# Altium schematic sheet ETH_CON.SchDoc
size A4
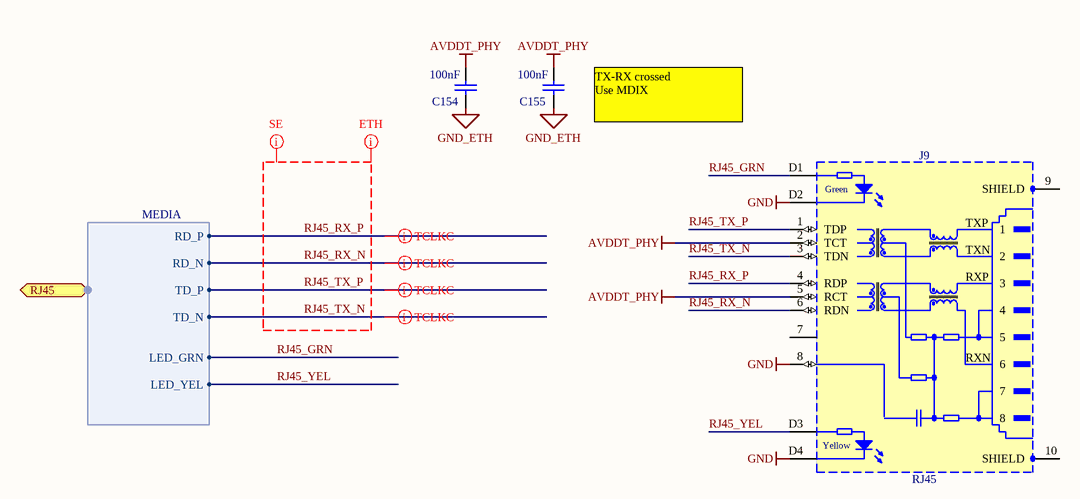
[diagram p0: ETH_CON.SchDoc]

## Parts
C154  100nF  [CAPC0603X33N]
C155  100nF  [CAPC0603X33N]
J9  RJ45  [TYCO_5-6605308-1]

## Ports
RJ45 (harness MEDIA)

## Harnesses
MEDIA: TD_P, TD_N, RD_P, RD_N, LED_GRN, LED_YEL

## Nets
AVDDT_PHY: C154.2 C155.2 J9.2(TCT) J9.5(RCT)
GND: J9.8 J9.D2 J9.D4
GND_ETH: C154.1 C155.1
RJ45_GRN: J9.D1 ; port RJ45.LED_GRN
RJ45_RX_N: J9.6(RDN) ; port RJ45.RD_N
RJ45_RX_P: J9.4(RDP) ; port RJ45.RD_P
RJ45_TX_N: J9.3(TDN) ; port RJ45.TD_N
RJ45_TX_P: J9.1(TDP) ; port RJ45.TD_P
RJ45_YEL: J9.D3 ; port RJ45.LED_YEL

Not connected (* = marked no-connect by the designer): J9 7 9(SHIELD) 10(SHIELD)

## Layout directives
differential pair: RJ45_RX_N, RJ45_RX_P, RJ45_TX_N, RJ45_TX_P
net class ETH: RJ45_RX_N, RJ45_RX_P, RJ45_TX_N, RJ45_TX_P
net class SE: RJ45_RX_N, RJ45_RX_P, RJ45_TX_N, RJ45_TX_P

## Notes on the sheet
- (near C155) TX-RX crossed
  Use MDIX
- (in symbol TYCO_5-6605308-1) Green; TXP; TXN; RXP; RXN; Yellow

## Library data of the parts
C154 C155 = CC0201_100NF_6.3V_10%_X5R: Non-polarised capacitor; Part Description: SMD Multilayer Chip Ceramic Capacitor; Manufacturer: GENERIC; Manufacturer1 Part Number: 02016D104KAT2A; Voltage: 6.3V; TC: X5R; Tolerance: ±10%; Table: Capacitors SMD; Part Number: CC0201_100NF_6.3V_10%_X5R; Component Kind: Standard; Component Type: Standard; Pin Count: 2; Value: 100nF; Status: Not Recommended; Manufacturer Part Number: CC0201_100NF_6.3V_10%_X5R; Case: 0201; Mounted: Yes; Socket: No; SMD: Yes; Manufacturer1 Example: AVX; Manufacturer1 ComponentHeight: 0.33mm; HelpURL: \\cern.ch\dfs\Applications\Altium\Datasheets\CC0201_X5R_AVX.pdf; Author: CERN DEM JLC; CreateDate: 2007-12-03; LatestRevisionDate: 2007-12-03
J9 = TYCO_5-6605308-1: 1 Port, Yellow/Green LEDs, RJ45 10/100Base-T Ethernet, Mag45 Connector Module With Integrated Magnetics; Manufacturer: TYCO ELECTRONICS; PressFit: No; Part Number: TYCO_5-6605308-1; Component Kind: Standard; Component Type: Standard; Pin Count: 14; Family: RJ45; Mounted: Yes; Socket: No; SMD: No; Sense: No; Status: None; Part Description: 1 Port, Yellow/Green LEDs, RJ45 10/100Base-T Ethernet, Mag45 Connector Module With Integrated Magnetics; Manufacturer Part Number: 5-6605308-1; ComponentHeight: 15.24mm; HelpURL: \\cern.ch\dfs\Applications\Altium\Datasheets\TYCO_5-6605308-1.pdf; Author: CERN DEM JLC; CreateDate: 23.08.2012; LatestRevisionDate: 23.08.2012